# Altium schematic sheet MR_UartConnector.SchDoc
size A4; CompanyName: BeeIonic; SheetNumber: 7; SheetTotal: 7
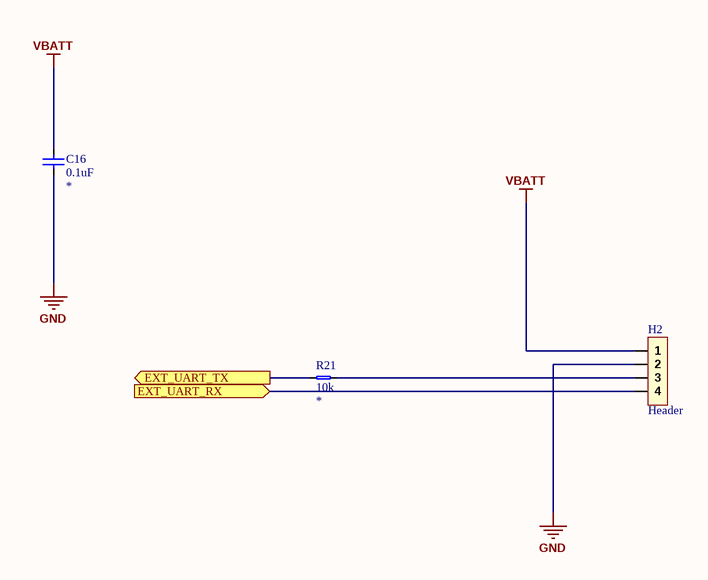
[diagram p0: MR_UartConnector.SchDoc]

## Parts
C16  value 0.1uF  [0603_CAP_LD]  (hidden comment: CerCap)
H2  Header  [HE14 1x4 Straight]
R21  value 10k  [0603_RES_LD]  (hidden comment: Resistor)

## Ports
EXT_UART_RX (in), EXT_UART_TX (out)

## Nets
GND: C16.1 H2.2
VBATT: C16.2 H2.1
EXT_UART_RX: H2.4 ; port EXT_UART_RX
EXT_UART_TX: R21.1 ; port EXT_UART_TX
NetH2_3: H2.3 R21.2

## Notes on the sheet
- Project :
- Title :
- Sheet:
- of
- Creation Date :
- Designer :
- Modified Date :

## Library data of the parts
C16 = CerCap: Ceramic Capacitor; Type: *; Voltage/Power: *; Package: *
H2 = Header_4x1: Header 4x1 PIns
R21 = Resistor: Precision: *; Package: *